# EAGLE schematic MusicPlayer (EAGLE 7.0.0)
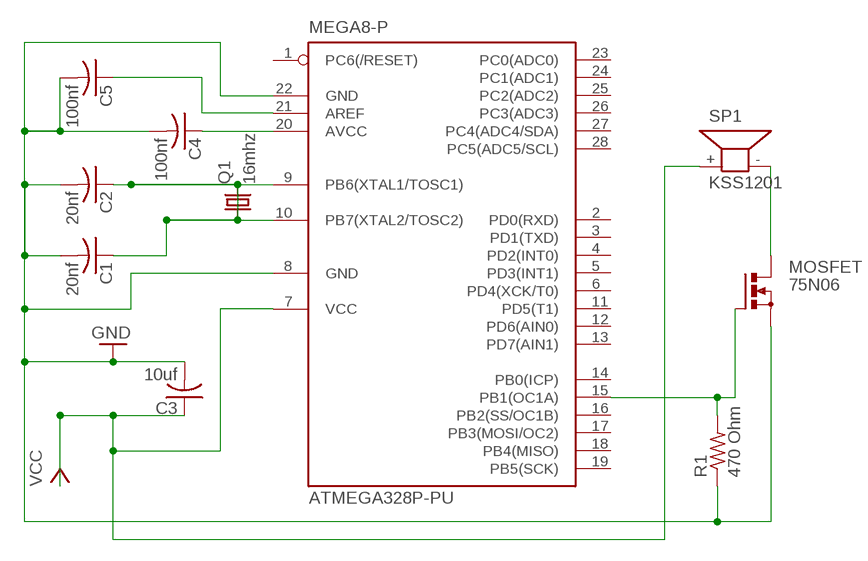
[diagram p0: schematic, sheet 1]

## Parts
ATMEGA328P-PU  MEGA8-P  [DIL28-3]
C1  20nf  C-US050-025X075  [C050-025X075]
C2  20nf  C-US050-025X075  [C050-025X075]
C3  10uf  C-US050-075X075  [C050-075X075]
C4  100nf  C-US050-025X075  [C050-025X075]
C5  100nf  C-US050-025X075  [C050-025X075]
MOSFET  75N06  PMOSFET_NTO220BH  [TO220BH]
Q1  16mhz  CRYSTALHC49U-V  [HC49U-V]
R1  470 Ohm  R-US_0204/5  [0204/5]
SP1  KSS1201  [KSS1201]

## Nets
AREF: ATMEGA328P-PU.21(AREF) C5.1
AVCC: ATMEGA328P-PU.20(AVCC) C4.1
GND: ATMEGA328P-PU.8(GND) ATMEGA328P-PU.22(GND) C1.2 C2.2 C3.2 C4.2 C5.2 MOSFET.S R1.1
N$1: MOSFET.D SP1.-
N$2: ATMEGA328P-PU.15(PB1(OC1A)) MOSFET.G R1.2
N$4: ATMEGA328P-PU.9(PB6(XTAL1/TOSC1)) ATMEGA328P-PU.10(PB7(XTAL2/TOSC2)) C1.1 C2.1 Q1.1 Q1.2
VCC: ATMEGA328P-PU.7(VCC) C3.1 SP1.+
Unconnected: ATMEGA328P-PU.1(PC6(/RESET)) ATMEGA328P-PU.2(PD0(RXD)) ATMEGA328P-PU.3(PD1(TXD)) ATMEGA328P-PU.4(PD2(INT0)) ATMEGA328P-PU.5(PD3(INT1)) ATMEGA328P-PU.6(PD4(XCK/T0)) ATMEGA328P-PU.11(PD5(T1)) ATMEGA328P-PU.12(PD6(AIN0)) ATMEGA328P-PU.13(PD7(AIN1)) ATMEGA328P-PU.14(PB0(ICP)) ATMEGA328P-PU.16(PB2(SS/OC1B)) ATMEGA328P-PU.17(PB3(MOSI/OC2)) ATMEGA328P-PU.18(PB4(MISO)) ATMEGA328P-PU.19(PB5(SCK)) ATMEGA328P-PU.23(PC0(ADC0)) ATMEGA328P-PU.24(PC1(ADC1)) ATMEGA328P-PU.25(PC2(ADC2)) ATMEGA328P-PU.26(PC3(ADC3)) ATMEGA328P-PU.27(PC4(ADC4/SDA)) ATMEGA328P-PU.28(PC5(ADC5/SCL))

## Library data of the parts
ATMEGA328P-PU = atmel:MEGA8-P: MICROCONTROLLER 8 Kbytes FLASH, 1 kbytes SRAM, 512 bytes EEPROM, USART, 4-channel 10 bit ADC, 2-channel 8 bit ADC Pin compatible with Atmega48, ATMega88, ATMega168 Source: avr.lbr; OC_FARNELL: unknown; OC_NEWARK: unknown
C1-C5 = resistor:C-US: CAPACITOR, American symbol
MOSFET = transistor-power:PMOSFET_N: Power MOSFET N-Channel
Q1 = crystal:CRYSTAL: CRYSTAL; OC_FARNELL: 1666969; OC_NEWARK: unknown
R1 = resistor:R-US_: RESISTOR, American symbol
SP1 = buzzer:KSS1201: SPEAKER Source: Schukat; OC_FARNELL: unknown; OC_NEWARK: unknown